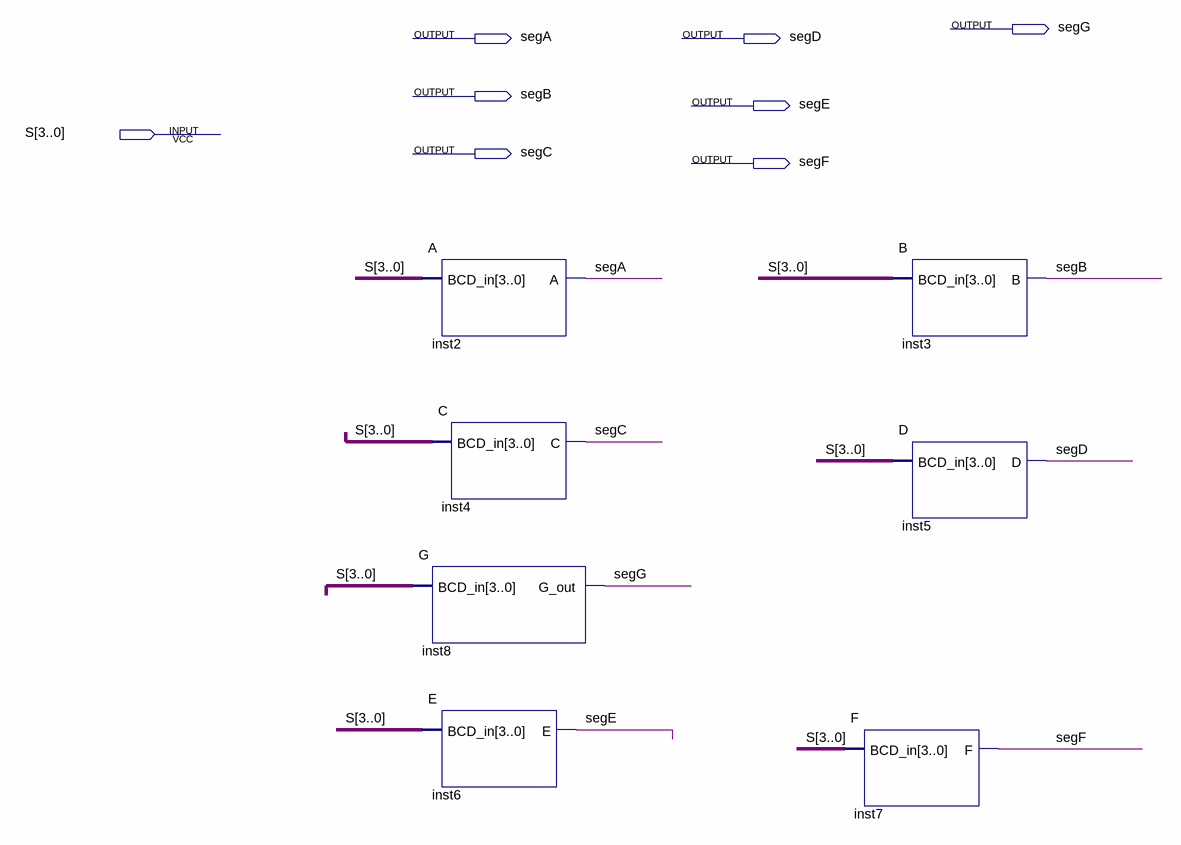
[diagram p0: schematic sheet]
// Quartus schematic segmentos.bdf as structural Verilog: 7 symbols, 8 pins
module segmentos (
  input  [3:0] S,
  output segG,
  output segA,
  output segD,
  output segB,
  output segE,
  output segC,
  output segF
);

  A inst2 (.BCD_in(S), .A(segA));
  G inst8 (.BCD_in(S), .G_out(segG));
  E inst6 (.BCD_in(S), .E(segE));
  C inst4 (.BCD_in(S), .C(segC));
  F inst7 (.BCD_in(S), .F(segF));
  B inst3 (.BCD_in(S), .B(segB));
  D inst5 (.BCD_in(S), .D(segD));
endmodule
